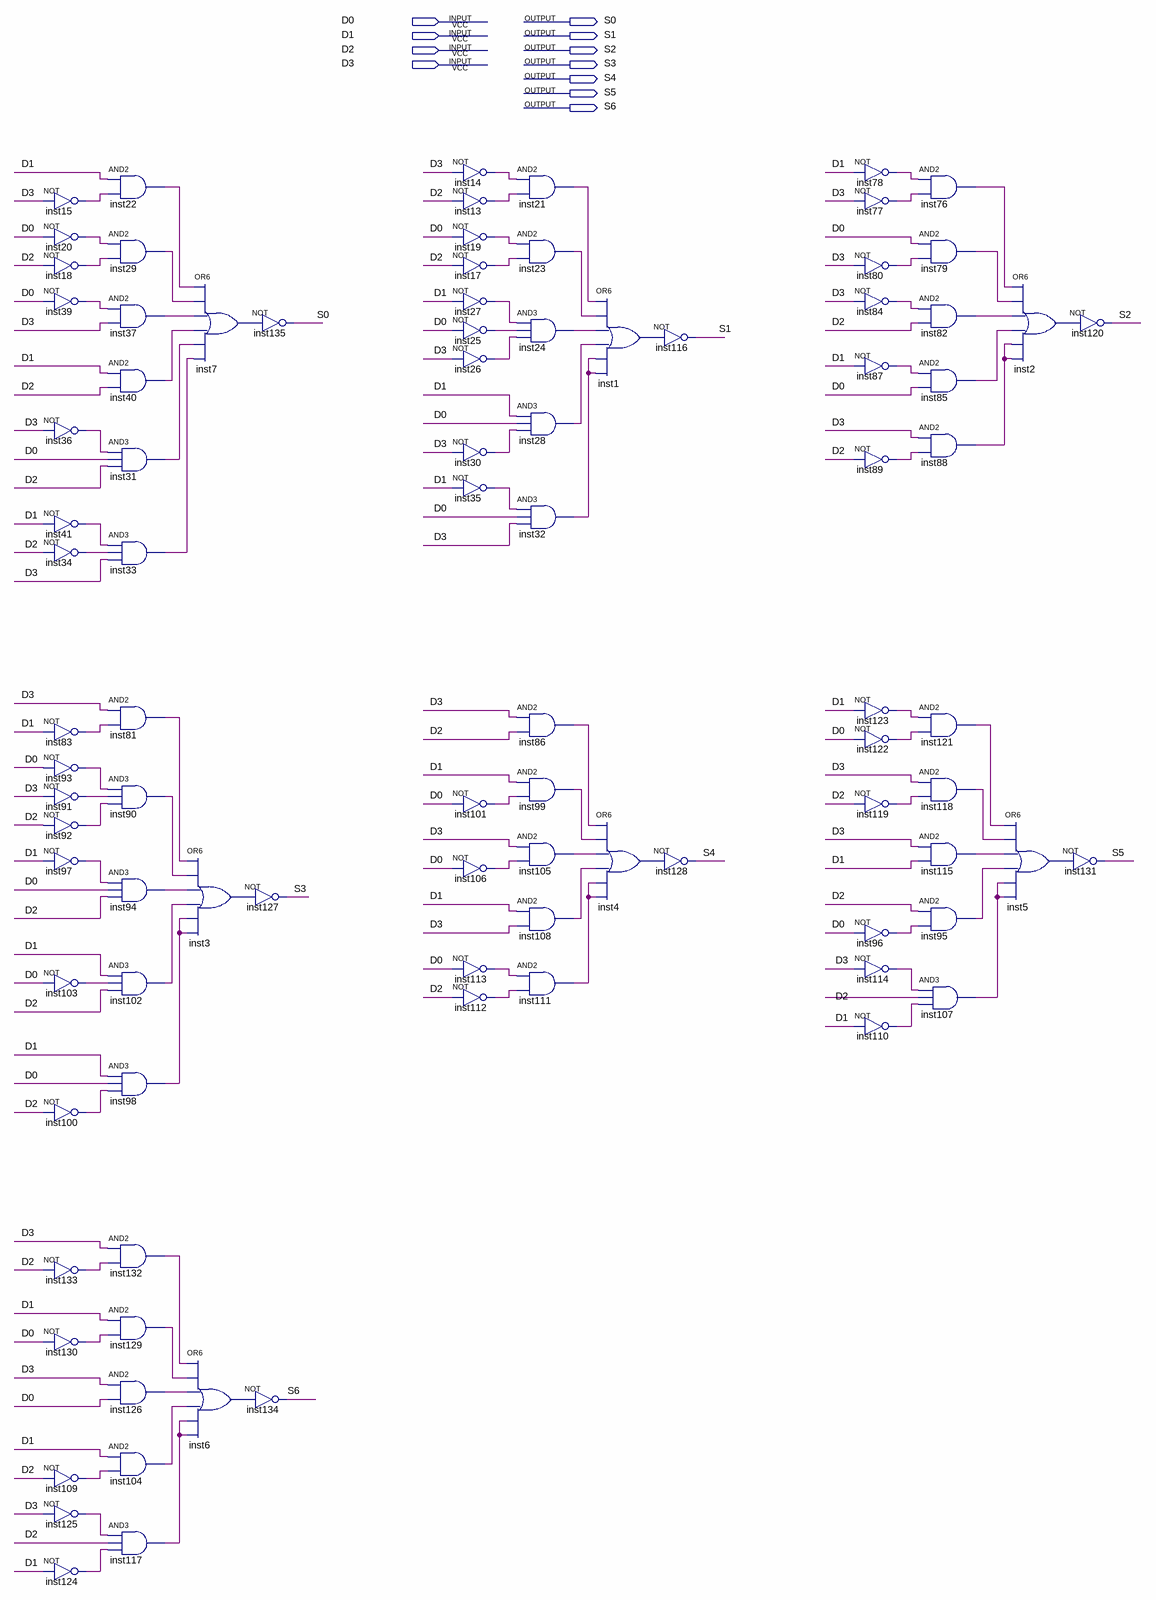
[diagram p0: schematic sheet]
// Quartus schematic 7SegmentDisplay.bdf as structural Verilog: 94 symbols, 11 pins
module \7SegmentDisplay  (
  input  D0,
  input  D1,
  input  D2,
  input  D3,
  output S0,
  output S1,
  output S2,
  output S3,
  output S4,
  output S5,
  output S6
);

  wire inst1_out, inst2_out, inst3_out, inst4_out, inst5_out, inst6_out, inst7_out, inst13_out, inst14_out,
       inst15_out, inst17_out, inst18_out, inst19_out, inst20_out, inst21_out, inst22_out, inst23_out,
       inst24_out, inst25_out, inst26_out, inst27_out, inst28_out, inst29_out, inst30_out, inst31_out,
       inst32_out, inst33_out, inst34_out, inst35_out, inst36_out, inst37_out, inst39_out, inst40_out,
       inst41_out, inst76_out, inst77_out, inst78_out, inst79_out, inst80_out, inst81_out, inst82_out,
       inst83_out, inst84_out, inst85_out, inst86_out, inst87_out, inst88_out, inst89_out, inst90_out,
       inst91_out, inst92_out, inst93_out, inst94_out, inst95_out, inst96_out, inst97_out, inst98_out,
       inst99_out, inst100_out, inst101_out, inst102_out, inst103_out, inst104_out, inst105_out, inst106_out,
       inst107_out, inst108_out, inst109_out, inst110_out, inst111_out, inst112_out, inst113_out,
       inst114_out, inst115_out, inst117_out, inst118_out, inst119_out, inst121_out, inst122_out,
       inst123_out, inst124_out, inst125_out, inst126_out, inst129_out, inst130_out, inst132_out, inst133_out;

  not inst15 (inst15_out, D3);
  not inst20 (inst20_out, D0);
  not inst18 (inst18_out, D2);
  not inst39 (inst39_out, D0);
  not inst36 (inst36_out, D3);
  not inst41 (inst41_out, D1);
  not inst34 (inst34_out, D2);
  not inst83 (inst83_out, D1);
  not inst93 (inst93_out, D0);
  not inst91 (inst91_out, D3);
  not inst92 (inst92_out, D2);
  not inst97 (inst97_out, D1);
  not inst103 (inst103_out, D0);
  not inst100 (inst100_out, D2);
  not inst133 (inst133_out, D2);
  not inst130 (inst130_out, D0);
  not inst109 (inst109_out, D2);
  not inst125 (inst125_out, D3);
  not inst124 (inst124_out, D1);
  and inst22 (inst22_out, D1, inst15_out);
  and inst29 (inst29_out, inst20_out, inst18_out);
  and inst37 (inst37_out, inst39_out, D3);
  and inst40 (inst40_out, D1, D2);
  and inst31 (inst31_out, inst36_out, D0, D2);
  and inst33 (inst33_out, inst41_out, inst34_out, D3);
  and inst81 (inst81_out, D3, inst83_out);
  and inst90 (inst90_out, inst93_out, inst91_out, inst92_out);
  and inst94 (inst94_out, inst97_out, D0, D2);
  and inst102 (inst102_out, D1, inst103_out, D2);
  and inst98 (inst98_out, D1, D0, inst100_out);
  and inst132 (inst132_out, D3, inst133_out);
  and inst129 (inst129_out, D1, inst130_out);
  and inst126 (inst126_out, D3, D0);
  and inst104 (inst104_out, D1, inst109_out);
  and inst117 (inst117_out, inst125_out, D2, inst124_out);
  or inst7 (inst7_out, inst22_out, inst29_out, inst37_out, inst40_out, inst31_out, inst33_out);
  or inst3 (inst3_out, inst81_out, inst90_out, inst94_out, inst102_out, inst98_out, inst98_out);
  or inst6 (inst6_out, inst132_out, inst129_out, inst126_out, inst104_out, inst117_out, inst117_out);
  not inst135 (S0, inst7_out);
  not inst127 (S3, inst3_out);
  not inst134 (S6, inst6_out);
  not inst14 (inst14_out, D3);
  not inst13 (inst13_out, D2);
  not inst19 (inst19_out, D0);
  not inst17 (inst17_out, D2);
  not inst27 (inst27_out, D1);
  not inst25 (inst25_out, D0);
  not inst26 (inst26_out, D3);
  not inst30 (inst30_out, D3);
  not inst35 (inst35_out, D1);
  not inst101 (inst101_out, D0);
  not inst106 (inst106_out, D0);
  not inst113 (inst113_out, D0);
  not inst112 (inst112_out, D2);
  and inst21 (inst21_out, inst14_out, inst13_out);
  and inst23 (inst23_out, inst19_out, inst17_out);
  and inst24 (inst24_out, inst27_out, inst25_out, inst26_out);
  and inst28 (inst28_out, D1, D0, inst30_out);
  and inst32 (inst32_out, inst35_out, D0, D3);
  and inst86 (inst86_out, D3, D2);
  and inst99 (inst99_out, D1, inst101_out);
  and inst105 (inst105_out, D3, inst106_out);
  and inst108 (inst108_out, D1, D3);
  and inst111 (inst111_out, inst113_out, inst112_out);
  or inst1 (inst1_out, inst21_out, inst23_out, inst24_out, inst28_out, inst32_out, inst32_out);
  or inst4 (inst4_out, inst86_out, inst99_out, inst105_out, inst108_out, inst111_out, inst111_out);
  not inst116 (S1, inst1_out);
  not inst128 (S4, inst4_out);
  not inst78 (inst78_out, D1);
  not inst77 (inst77_out, D3);
  not inst80 (inst80_out, D3);
  not inst84 (inst84_out, D3);
  not inst87 (inst87_out, D1);
  not inst89 (inst89_out, D2);
  not inst123 (inst123_out, D1);
  not inst122 (inst122_out, D0);
  not inst119 (inst119_out, D2);
  not inst96 (inst96_out, D0);
  not inst114 (inst114_out, D3);
  not inst110 (inst110_out, D1);
  and inst76 (inst76_out, inst78_out, inst77_out);
  and inst79 (inst79_out, D0, inst80_out);
  and inst82 (inst82_out, inst84_out, D2);
  and inst85 (inst85_out, inst87_out, D0);
  and inst88 (inst88_out, D3, inst89_out);
  and inst121 (inst121_out, inst123_out, inst122_out);
  and inst118 (inst118_out, D3, inst119_out);
  and inst115 (inst115_out, D3, D1);
  and inst95 (inst95_out, D2, inst96_out);
  and inst107 (inst107_out, inst114_out, D2, inst110_out);
  or inst2 (inst2_out, inst76_out, inst79_out, inst82_out, inst85_out, inst88_out, inst88_out);
  or inst5 (inst5_out, inst121_out, inst118_out, inst115_out, inst95_out, inst107_out, inst107_out);
  not inst120 (S2, inst2_out);
  not inst131 (S5, inst5_out);
endmodule
